# EAGLE design reed_relay_switcher (EAGLE 6.6.0)
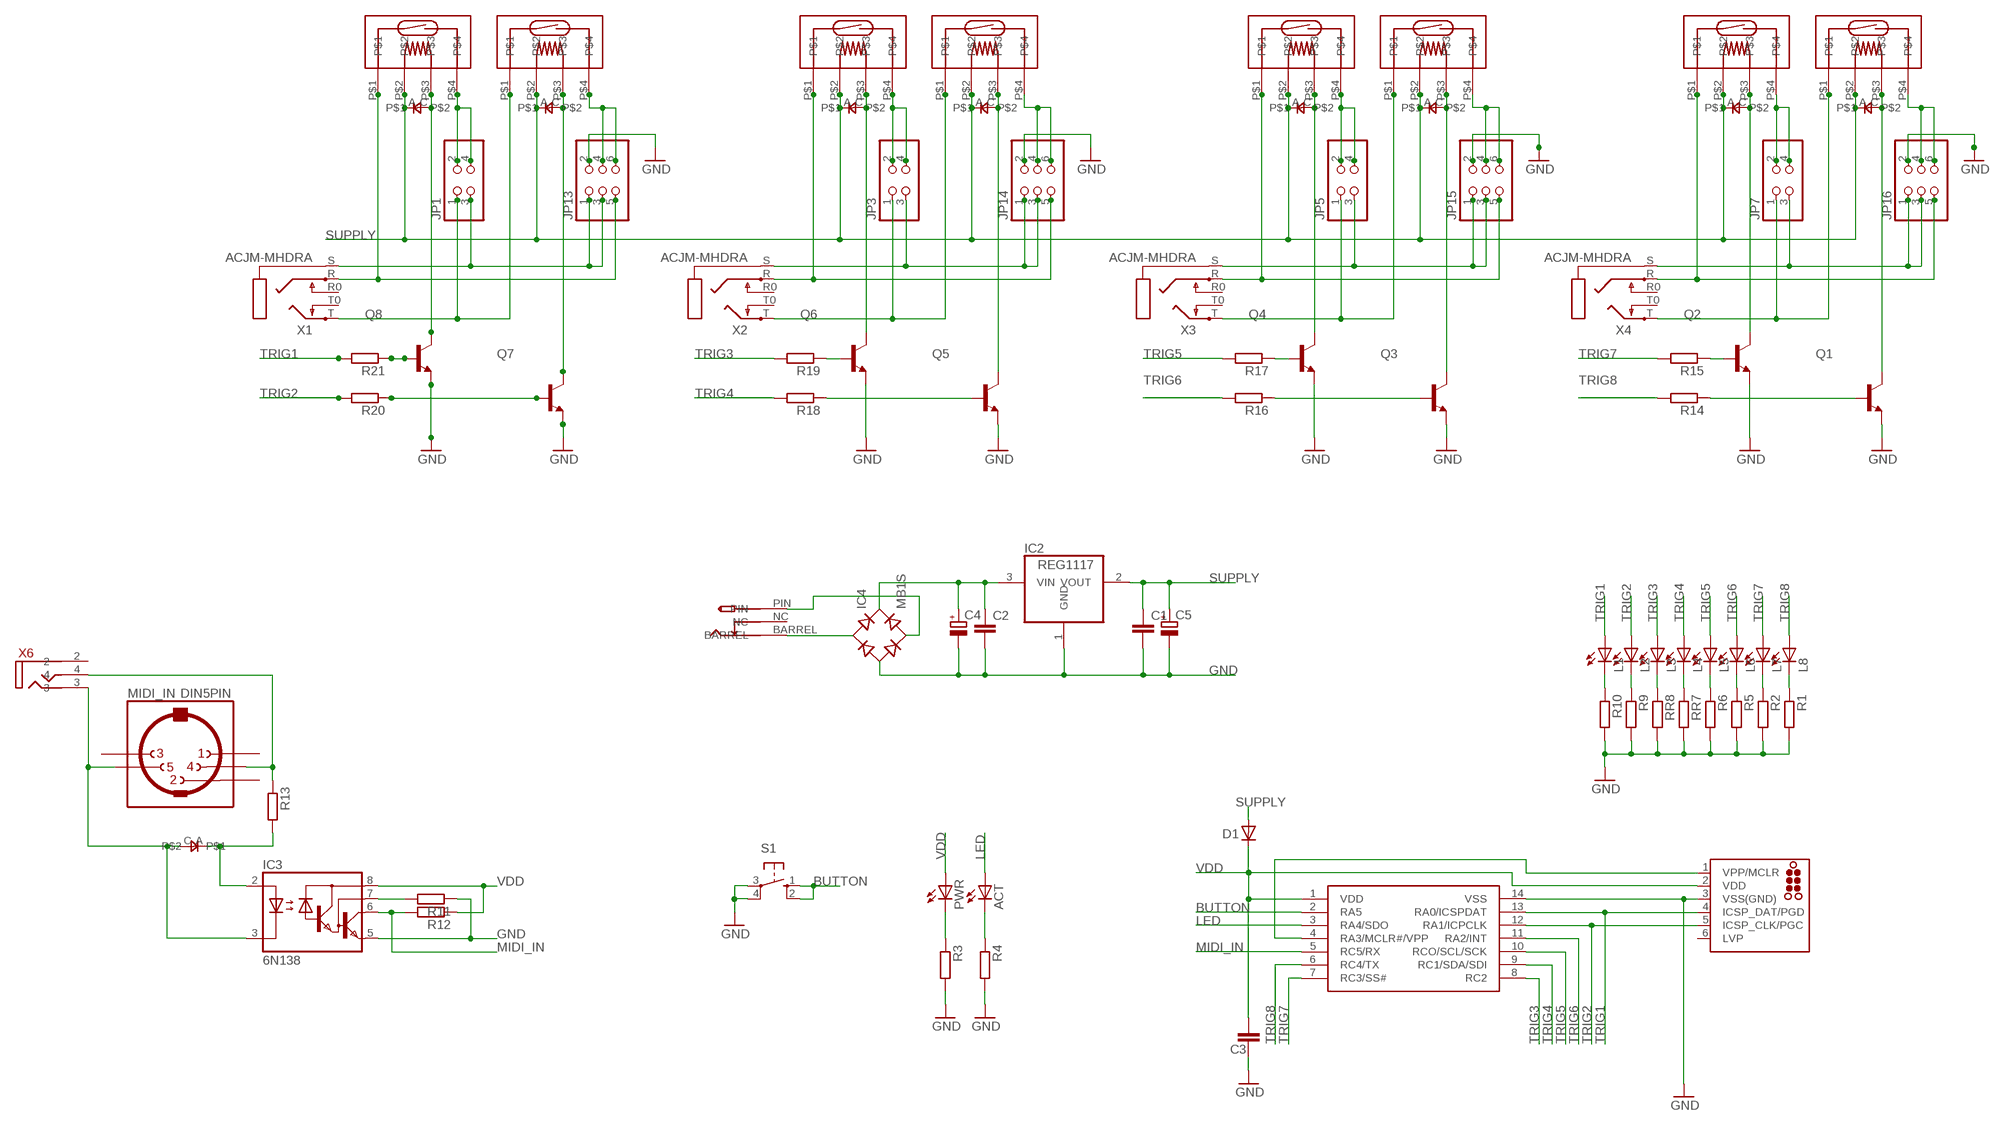
[diagram p0: schematic, sheet 1]

## Parts
ACT  LED3MM  [LED3MM]
C1  C-EUC0805  [C0805]
C2  C-EUC0805  [C0805]
C3  C-EUC0805  [C0805]
C4  CPOL-EUE2,5-6E  [E2,5-6E]
C5  CPOL-EUE2,5-6E  [E2,5-6E]
D1  CGRM4001-G  [SOD-123_MINI-SMA]
D2  0805DIODE  [0805DIODE]
D3  0805DIODE  [0805DIODE]
D4  0805DIODE  [0805DIODE]
D5  0805DIODE  [0805DIODE]
D6  0805DIODE  [0805DIODE]
D7  0805DIODE  [0805DIODE]
D8  0805DIODE  [0805DIODE]
D9  0805DIODE  [0805DIODE]
D10  0805DIODE  [0805DIODE]
IC1  PIC16F1825SO14  [SO14]
IC2  REG1117  [SOT223]
IC3  6N138  [DIL08]
IC4  MB1S  [SOIC-4]
ICSP  TC2030-MCP-NL  [TC2030-MCP-NL]
JP1  PINHD-2X2  [2X02]
JP3  PINHD-2X2  [2X02]
JP5  PINHD-2X2  [2X02]
JP7  PINHD-2X2  [2X02]
JP13  PINHD-2X3  [2X03]
JP14  PINHD-2X3  [2X03]
JP15  PINHD-2X3  [2X03]
JP16  PINHD-2X3  [2X03]
L1  LED3MM  [LED3MM]
L2  LED3MM  [LED3MM]
L3  LED3MM  [LED3MM]
L4  LED3MM  [LED3MM]
L5  LED3MM  [LED3MM]
L6  LED3MM  [LED3MM]
L7  LED3MM  [LED3MM]
L8  LED3MM  [LED3MM]
MIDI_IN  DIN5PIN  [EDGEDIN]
PWR  LED3MM  [LED3MM]
Q1  MMBT3904LT1-NPN-SOT23-BEC  [SOT23-BEC]
Q2  MMBT3904LT1-NPN-SOT23-BEC  [SOT23-BEC]
Q3  MMBT3904LT1-NPN-SOT23-BEC  [SOT23-BEC]
Q4  MMBT3904LT1-NPN-SOT23-BEC  [SOT23-BEC]
Q5  MMBT3904LT1-NPN-SOT23-BEC  [SOT23-BEC]
Q6  MMBT3904LT1-NPN-SOT23-BEC  [SOT23-BEC]
Q7  MMBT3904LT1-NPN-SOT23-BEC  [SOT23-BEC]
Q8  MMBT3904LT1-NPN-SOT23-BEC  [SOT23-BEC]
R1  R-EU_R0805  [R0805]
R2  R-EU_R0805  [R0805]
R3  R-EU_R0805  [R0805]
R4  R-EU_R0805  [R0805]
R5  R-EU_R0805  [R0805]
R6  R-EU_R0805  [R0805]
R9  R-EU_R0805  [R0805]
R10  R-EU_R0805  [R0805]
R11  R-EU_R0805  [R0805]
R12  R-EU_R0805  [R0805]
R13  R-EU_R0805  [R0805]
R14  R-EU_R0805  [R0805]
R15  R-EU_R0805  [R0805]
R16  R-EU_R0805  [R0805]
R17  R-EU_R0805  [R0805]
R18  R-EU_R0805  [R0805]
R19  R-EU_R0805  [R0805]
R20  R-EU_R0805  [R0805]
R21  R-EU_R0805  [R0805]
RLY1  9007-REED-RELAY  [9007-REED-RELAY]
RLY2  9007-REED-RELAY  [9007-REED-RELAY]
RLY3  9007-REED-RELAY  [9007-REED-RELAY]
RLY4  9007-REED-RELAY  [9007-REED-RELAY]
RLY5  9007-REED-RELAY  [9007-REED-RELAY]
RLY6  9007-REED-RELAY  [9007-REED-RELAY]
RLY7  9007-REED-RELAY  [9007-REED-RELAY]
RLY8  9007-REED-RELAY  [9007-REED-RELAY]
RR7  R-EU_R0805  [R0805]
RR8  R-EU_R0805  [R0805]
S1  10-XX  [B3F-10XX]
U$9  PWR_SOCKET_2_1MM  [PWR_SOCKET_2_1MM]
X1  ACJM-MHDRA  [ACJM-MHDR]
X2  ACJM-MHDRA  [ACJM-MHDR]
X3  ACJM-MHDRA  [ACJM-MHDR]
X4  ACJM-MHDRA  [ACJM-MHDR]
X6  VERTICAL_3_5MM_SOCKET  [VERTICAL_3_5MM_SOCKET]

## Nets
BUTTON: IC1.2(RA5) S1.1(S) S1.2(S1)
GND: C1.2 C2.2 C3.2 C4.- C5.- IC1.14(VSS) IC2.1(GND) IC3.5(GND) IC4.- ICSP.3(VSS(GND)) JP13.2 JP14.2 JP15.2 JP16.2 Q1.E Q2.E Q3.E Q4.E Q5.E Q6.E Q7.E Q8.E R1.2 R2.2 R3.2 R4.2 R5.2 R6.2 R9.2 R10.2 R11.1 RR7.2 RR8.2 S1.3(P) S1.4(P1)
LED: ACT.A IC1.3(RA4/SDO)
MIDI_IN: IC1.5(RC5/RX) IC3.6(VO) R12.2
N$1: JP1.2 JP1.4 RLY1.P$4
N$2: JP13.4 JP13.6 RLY2.P$4
N$3: JP13.5 RLY1.P$1 X1.R
N$4: JP1.1 RLY2.P$1 X1.T
N$5: JP1.3 JP13.1 JP13.3 X1.S
N$6: D9.C Q7.C RLY2.P$3
N$7: Q8.B R21.1
N$8: Q7.B R20.1
N$9: JP3.2 JP3.4 RLY3.P$4
N$10: D10.C Q8.C RLY1.P$3
N$11: JP14.4 JP14.6 RLY4.P$4
N$12: JP14.5 RLY3.P$1 X2.R
N$13: JP3.1 RLY4.P$1 X2.T
N$14: JP3.3 JP14.1 JP14.3 X2.S
N$15: D8.C Q6.C RLY3.P$3
N$16: D7.C Q5.C RLY4.P$3
N$17: Q6.B R19.1
N$18: Q5.B R18.1
N$19: JP5.2 JP5.4 RLY5.P$4
N$20: JP15.4 JP15.6 RLY6.P$4
N$21: JP15.5 RLY5.P$1 X3.R
N$22: JP5.1 RLY6.P$1 X3.T
N$23: JP5.3 JP15.1 JP15.3 X3.S
N$24: D6.C Q4.C RLY5.P$3
N$25: D5.C Q3.C RLY6.P$3
N$26: Q4.B R17.1
N$27: Q3.B R16.1
N$28: JP16.4 JP16.6 RLY8.P$4
N$29: JP7.2 JP7.4 RLY7.P$4
N$30: JP16.5 RLY7.P$1 X4.R
N$31: JP7.1 RLY8.P$1 X4.T
N$32: JP7.3 JP16.1 JP16.3 X4.S
N$33: D4.C Q2.C RLY7.P$3
N$34: D3.C Q1.C RLY8.P$3
N$35: Q2.B R15.1
N$36: Q1.B R14.1
N$37: D2.C IC3.3(C) MIDI_IN.5 X6.3
N$38: MIDI_IN.4 R13.1 X6.4
N$39: D2.A IC3.2(A) R13.2
N$40: IC3.7(VB) R11.2
N$41: PWR.K(C) R3.1
N$43: C2.1 C4.+ IC2.3(VIN) IC4.+
N$46: IC4.~1(AC1) U$9.BARREL
N$47: IC4.~2(AC2) U$9.PIN
N$48: ACT.K(C) R4.1
N$49: L1.K(C) R10.1
N$50: L2.K(C) R9.1
N$51: L3.K(C) RR8.1
N$52: L4.K(C) RR7.1
N$53: L5.K(C) R6.1
N$54: L6.K(C) R5.1
N$55: L7.K(C) R2.1
N$56: L8.K(C) R1.1
SUPPLY: C1.1 C5.+ D1.A D3.A D4.A D5.A D6.A D7.A D8.A D9.A D10.A IC2.2(VOUT) RLY1.P$2 RLY2.P$2 RLY3.P$2 RLY4.P$2 RLY5.P$2 RLY6.P$2 RLY7.P$2 RLY8.P$2
TRIG1: IC1.13(RA0/ICSPDAT) ICSP.4(ICSP_DAT/PGD) L1.A R21.2
TRIG2: IC1.12(RA1/ICPCLK) ICSP.5(ICSP_CLK/PGC) L2.A R20.2
TRIG3: IC1.8(RC2) L3.A R19.2
TRIG4: IC1.9(RC1/SDA/SDI) L4.A R18.2
TRIG5: IC1.10(RCO/SCL/SCK) L5.A R17.2
TRIG6: IC1.11(RA2/INT) L6.A R16.2
TRIG7: IC1.7(RC3/SS#) L7.A R15.2
TRIG8: IC1.6(RC4/TX) L8.A R14.2
VDD: C3.1 D1.C IC1.1(VDD) IC3.8(VCC) ICSP.2(VDD) PWR.A R12.1
VPP: IC1.4(RA3/MCLR#/VPP) ICSP.1(VPP/MCLR)
Unconnected: ICSP.6(LVP) MIDI_IN.1 MIDI_IN.2 MIDI_IN.3 U$9.NC X1.R0 X1.T0 X2.R0 X2.T0 X3.R0 X3.T0 X4.R0 X4.T0 X6.2

## Library data of the parts
ACT L1-L8 PWR = led:LED: LED OSRAM: - CHIPLED LG R971, LG N971, LY N971, LG Q971, LY Q971, LO R971, LY R971 LH N974, LH R974 LS Q976, LO Q976, LY Q976 LO Q996 - Hyper CHIPLED LW Q18S LB Q993, LB Q99A, LB R99A - SideLED LS A670, LO A670, LY A670, LG A670, LP A670 LB A673, LV A673, LT A673, LW A673 LH A674 LY A675 LS A676, LA A676, LO A676, LY A676, LW A676 LS A679, LY A679, LG A679 - Hyper Micro SIDELED® LS Y876, LA Y876, LO Y876, LY Y876 LT Y87S - SmartLED LW L88C, LW L88S LB L89C, LB L89S, LG L890 LS L89K, LO L89K, LY L89K LS L896, LA L896, LO L896, LY L896 - TOPLED LS T670, LO T670, LY T670, LG T670, LP T670 LSG T670, LSP T670, LSY T670, LOP T670, LYG T670 LG T671, LOG T671, LSG T671 LB T673, LV T673, LT T673, LW T673 LH T674 LS T676, LA T676, LO T676, LY T676, LB T676, LH T676, LSB T676, LW T676 LB T67C, LV T67C, LT T67C, LS T67K, LO T67K, LY T67K, LW E67C LS E67B, LA E67B, LO E67B, LY E67B, LB E67C, LV E67C, LT E67C LW T67C LS T679, LY T679, LG T679 LS T770, LO T770, LY T770, LG T770, LP T770 LB T773, LV T773, LT T773, LW T773 LH T774 LS E675, LA E675, LY E675, LS T675 LS T776, LA T776, LO T776, LY T776, LB T776 LHGB T686 LT T68C, LB T68C - Hyper Mini TOPLED® LB M676 - Mini TOPLED Santana® LG M470 LS M47K, LO M47K, LY M47K Source: http://www.osram.convergy.de LUXEON: - LUMILED® LXK2-PW12-R00, LXK2-PW12-S00, LXK2-PW14-U00, LXK2-PW14-V00 LXK2-PM12-R00, LXK2-PM12-S00, LXK2-PM14-U00 LXK2-PE12-Q00, LXK2-PE12-R00, LXK2-PE12-S00, LXK2-PE14-T00, LXK2-PE14-U00 LXK2-PB12-K00, LXK2-PB12-L00, LXK2-PB12-M00, LXK2-PB14-N00, LXK2-PB14-P00, LXK2-PB14-Q00 LXK2-PR12-L00, LXK2-PR12-M00, LXK2-PR14-Q00, LXK2-PR14-R00 LXK2-PD12-Q00, LXK2-PD12-R00, LXK2-PD12-S00 LXK2-PH12-R00, LXK2-PH12-S00 LXK2-PL12-P00, LXK2-PL12-Q00, LXK2-PL12-R00 Source: www.luxeon.com KINGBRIGHT: KA-3528ASYC Source: www.kingbright.com
C1-C3 = rcl:C-EU: CAPACITOR, European symbol
C4 C5 = rcl:CPOL-EU: POLARIZED CAPACITOR, European symbol
D1 = diode:CGRM400*-G: Molded plasitc,JEDEC SOD-123/Mini SMA Source: Comchip CGRM4001-G.pdf
D2-D10 = jasons_stuff:0805DIODE
IC1 = jasons_stuff:PIC16F1825
IC2 = burr-brown:REG1117: 800mA and 1A Low Dropout (LDO) Positive Regulator 1.8V, 2.5V, 2.85V, 3.3V, 5V, and Adj; MPN: REG1117; OC_FARNELL: 1097566; OC_NEWARK: 14P6981
IC3 = optocoupler:6N138: MOTOROLA OPTO COUPLER; MF: VISHAY/TELEFUNKEN; MPN: 6N138; OC_FARNELL: 9860150; OC_NEWARK: 35K5294
IC4 = rectifier:MB*S: Bridge Rectifier Source: http://www.fairchildsemi.com/ds/MB/MB6S.pdf
ICSP = tag-connect:TC2030: TAG-CONNECT ICSP Connector Manufacturer: Tag-Connect <http://www.tag-connect.com> Cable for easy In-Circuit Serial Programming. Designed for Microchip ICD2, suitable for many others. Two variants - one "with legs" (for hands-free fit on PCB) and another "without legs" for quick programming. PAD Description 1 MCLR/Vpp 2 Vdd 3 GND 4 PGD (ISPDAT) 5 PGC (ISPCLK) 6 nc (used for LVP) ©2009 ROFA.cz - modified and updated by Robert Darlington ‹rdarlington@gmail.com›
JP1 JP3 JP5 JP7 = pinhead:PINHD-2X2: PIN HEADER
JP13-JP16 = pinhead:PINHD-2X3: PIN HEADER
MIDI_IN = jason_eagle6:DIN5PIN: Female CONNECTOR 5 pins 90 deg. with shield, horizontal (DIN 41524)
Q1-Q8 = transistor:*-NPN-: NPN Transistror BF959 corrected 2008.03.06
R1-R6 R9-R21 RR7 RR8 = rcl:R-EU_: RESISTOR, European symbol
RLY1-RLY8 = jason_eagle6:9007-REED-RELAY
S1 = switch-omron:10-XX: OMRON SWITCH; MPN: B3F-1000; OC_FARNELL: 176432; OC_NEWARK: 36M3542
U$9 = jason_eagle6:PWR_SOCKET_2_1MM
X1-X4 = jason_eagle6:ACJM-MHDRA: MIC/HEADPHONE JACK Stereo jack with two switches. Kycon STX3100, CUI SJ1-3555NG and/or 4UCon 05544
X6 = jason_eagle6:VERTICAL_3_5MM_SOCKET

## Board
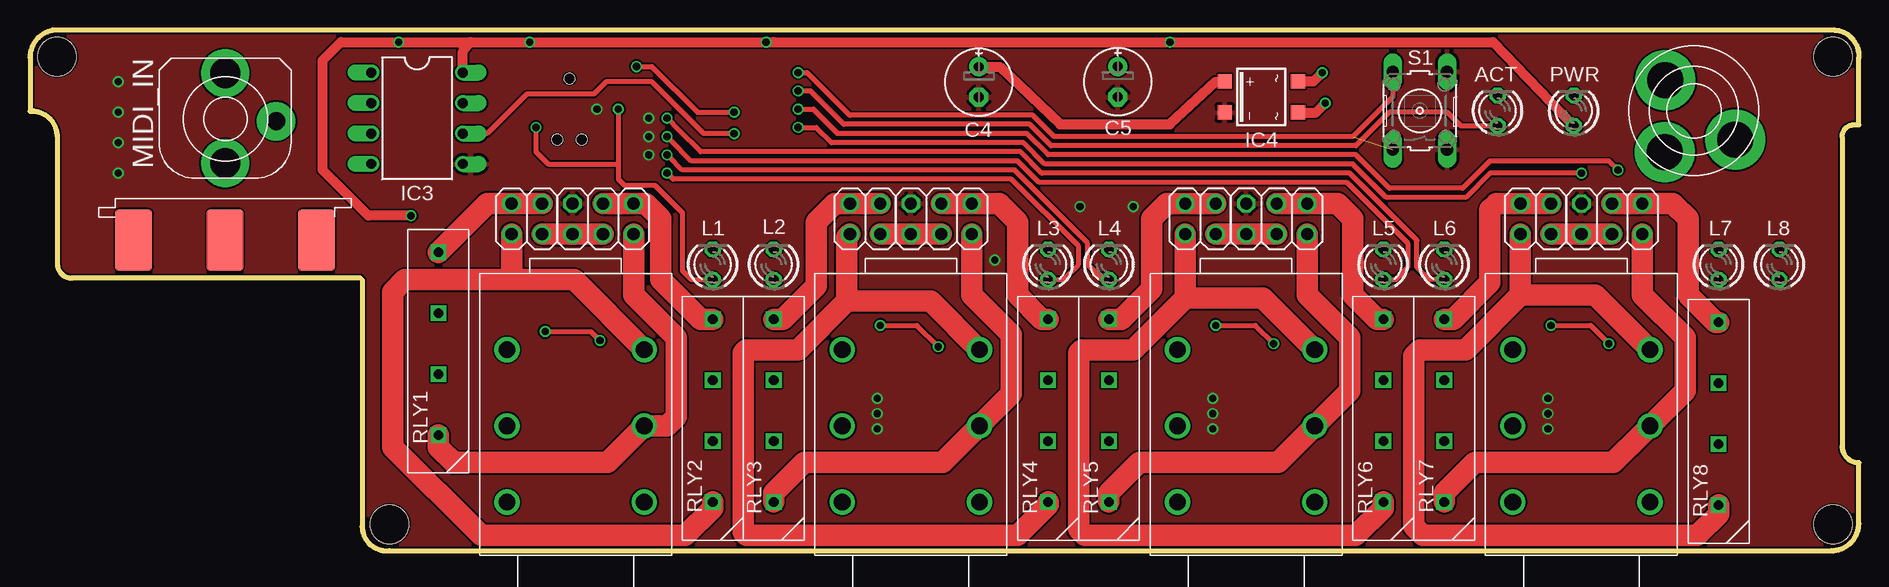
[diagram p1: board, top side]
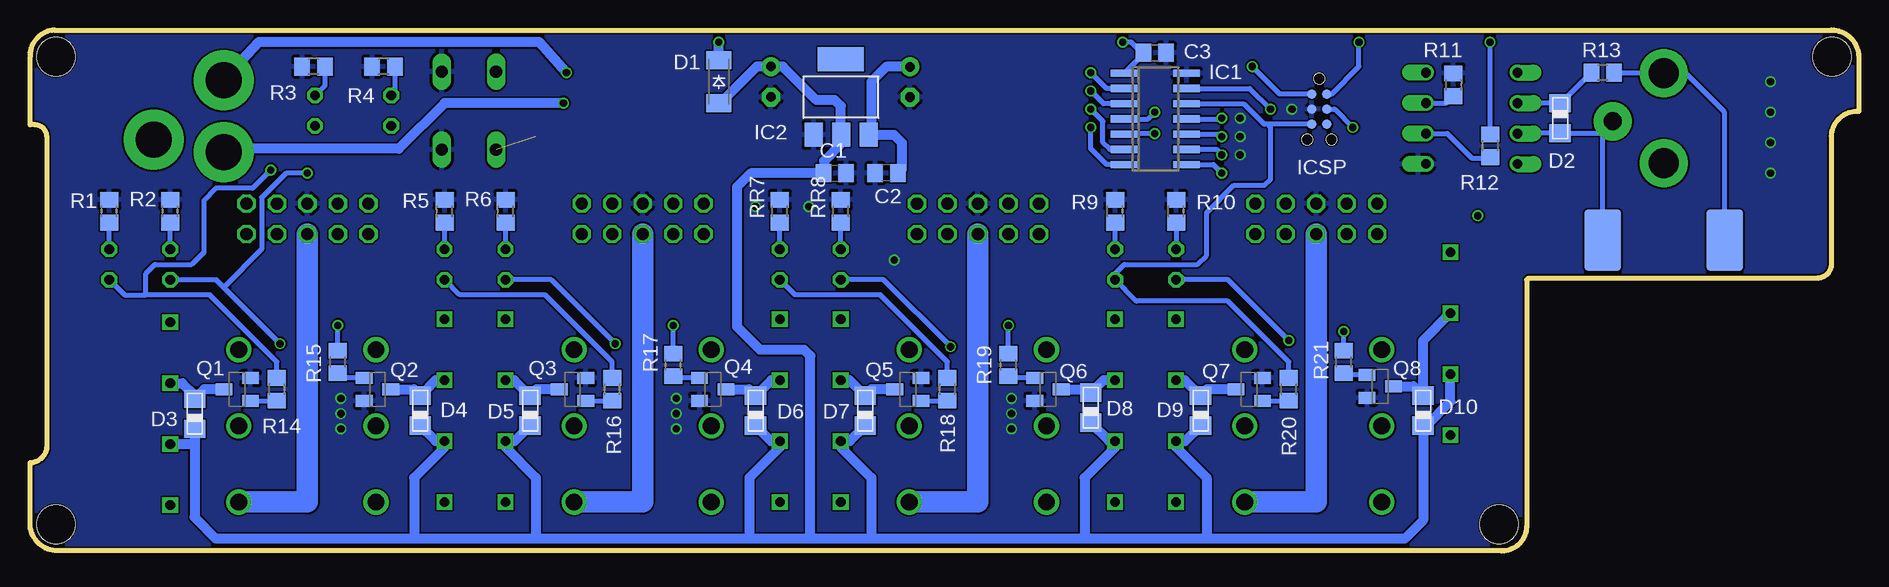
[diagram p2: board, bottom side, seen from below]

Size 152.4 x 43.45 mm. Coordinates in mm from the lower left corner, seen from the top.
Outline: 27.56,22.75 3.48,22.75
Outline: 3.48,22.75 3.43,22.75
Outline: 27.69,22.62 27.69,2.05 arc97 29.97,0.01 150.11,0.01 arc90 152.4,2.3 152.4,7.35 arc-90 151,8.75 151,34.53
Outline: 151,34.56 151,34.53
Outline: 2.29,34.56 2.29,34.53
Outline: 2.29,34.53 2.29,23.94 arc90 3.48,22.75
Outline: 2.29,34.53 arc90 0.15,36.67 0,36.67 0,41.16 arc-90 2.29,43.45 150.37,43.45 arc-90 152.4,41.16 152.4,35.55 152.02,35.55 arc90 151,34.53
Copper layers (1*16): Top 0.035mm / dielectric 1.5mm / Bottom 0.035mm
Design rules "hackvana": minimum track width 6mil, minimum drill 0.3mm, track to track 6mil, track to pad 9mil, pad to pad 6mil, via to via 6mil, smd to smd 0mil, copper to edge 6mil, drill to drill 6mil, minimum pad ring 10mil, minimum via ring 6mil, stop-mask expansion 2mil, vias tented up to drill 100mil, thermal gap 10mil
Holes 3.2 mm at 2.25,41.22 29.97,2.22 150.25,41.22 150.25,2.22

### Footprints (pad centres in the part's own frame; a part is rotated, then mirrored left to right if it is on the bottom)
LED3MM = drill 0.813 octagon: A -1.27,0; K 1.27,0
C0805 = smd 1.3 x 1.5: 1 -0.95,0; 2 0.95,0
E2,5-6E = drill 0.813 pad 1.575: + -1.27,0 | drill 0.813 pad 1.575 octagon: - 1.27,0
SOD-123_MINI-SMA = smd 1.5 x 2.1: A 1.8,0; C -1.8,0
0805DIODE = smd 1.524 x 1.778: A -1.262,-0.005; C 1.238,-0.005
SO14 = smd 0.6 x 2.2: 1 -3.81,-2.6; 2 -2.54,-2.6; 3 -1.27,-2.6; 4 0,-2.6; 5 1.27,-2.6; 6 2.54,-2.6; 7 3.81,-2.6; 8 3.81,2.6; 9 2.54,2.6; 10 1.27,2.6; 11 0,2.6; 12 -1.27,2.6; 13 -2.54,2.6; 14 -3.81,2.6
SOT223 = smd 1.499 x 2.007: 1 -2.261,-3.15; 2 0.025,-3.15; 3 2.311,-3.15 | smd 3.81 x 2.007: 4 0,3.15
DIL08 = drill 0.813 offset: 1 -3.81,-3.81; 2 -1.27,-3.81; 3 1.27,-3.81; 4 3.81,-3.81; 5 3.81,3.81; 6 1.27,3.81; 7 -1.27,3.81; 8 -3.81,3.81
SOIC-4 = smd 1.2 x 1.2: + 1.3,3.05; - -1.3,3.05; ~1 -1.3,-3.05; ~2 1.3,-3.05
TC2030-MCP-NL = smd 0.787 x 0.787: 1 1.27,-0.635; 2 1.27,0.635; 3 2.54,-0.635; 4 2.54,0.635; 5 3.81,-0.635; 6 3.81,0.635 | hole 0.889: 0,0; 5.08,-1.016; 5.08,1.016
2X02 = drill 1.016 octagon: 1 -1.27,-1.27; 2 -1.27,1.27; 3 1.27,-1.27; 4 1.27,1.27
2X03 = drill 1.016 octagon: 1 -2.54,-1.27; 2 -2.54,1.27; 3 0,-1.27; 4 0,1.27; 5 2.54,-1.27; 6 2.54,1.27
EDGEDIN = smd 3.048 x 5.08: 1 -7.62,-10.16; 2 0,-10.16; 3 7.62,-10.16 | smd 3.048 x 5.08 bottom: 4 -5.08,-10.16; 5 5.08,-10.16
SOT23-BEC = smd 1 x 1.4: B -0.95,-1.1; C 0,1.1; E 0.95,-1.1
R0805 = smd 1.3 x 1.5: 1 -0.95,0; 2 0.95,0
9007-REED-RELAY = drill 0.8 square: P$1 0,7.62; P$2 0,2.54; P$3 0,-2.54; P$4 0,-7.62
B3F-10XX = drill 1.016 long: 1 -3.251,2.261; 2 3.251,2.261; 3 -3.251,-2.261; 4 3.251,-2.261
PWR_SOCKET_2_1MM = drill 3 pad 5: BARREL 0,4.2; NC -4.2,0; PIN 3.4,-0.7
ACJM-MHDR = drill 1.397: R 0,5.715; R0 0,-5.715; S 6.35,5.715; S0 6.35,-5.715; T -6.35,5.715; T0 -6.35,-5.715
VERTICAL_3_5MM_SOCKET = drill 2.5 pad 4: 2 0,-3.75; 4 0,3.75 | drill 1.5 pad 3.2: 3 4.25,-0.25

### Placement (x,y rotation side)
ACT  122.3,36.72 90 top
C1  85.34,31.51 0 bottom
C2  81.03,31.51 180 bottom
C3  58.67,41.54 0 bottom
C4  79.07,39.1 270 top
C5  90.65,39.13 270 top
D1  95,39.13 270 bottom
D2  24.89,36.08 270 bottom
D3  138.68,11.44 90 bottom
D4  119.89,11.7 90 bottom
D5  110.74,11.7 90 bottom
D6  91.95,11.7 90 bottom
D7  82.8,11.7 90 bottom
D8  64.01,11.95 90 bottom
D9  54.86,11.7 90 bottom
D10  36.32,11.7 90 bottom
IC1  58.62,36.03 270 bottom
IC2  84.84,37.86 0 bottom
IC3  32.26,36.08 270 top
IC4  102.62,37.86 90 top
ICSP  44.96,39.38 270 bottom
JP1  41.4,27.7 0 top
JP3  69.6,27.7 0 top
JP5  97.54,27.7 0 top
JP7  125.48,27.7 0 top
JP13  47.75,27.7 0 top
JP14  75.95,27.7 0 top
JP15  103.89,27.7 0 top
JP16  131.83,27.7 0 top
L1  56.9,23.89 90 top
L2  61.98,23.89 90 top
L3  84.84,23.89 90 top
L4  89.92,23.89 90 top
L5  112.78,23.89 90 top
L6  117.86,23.89 90 top
L7  140.72,23.89 90 top
L8  145.8,23.89 90 top
MIDI_IN  16.26,36.08 0 top
PWR  128.65,36.72 90 top
Q1  135.13,13.48 90 bottom
Q2  123.44,13.48 270 bottom
Q3  107.19,13.48 90 bottom
Q4  95.5,13.48 270 bottom
Q5  79.25,13.48 90 bottom
Q6  67.56,13.48 270 bottom
Q7  50.8,13.48 90 bottom
Q8  39.88,13.73 270 bottom
R1  145.8,28.33 90 bottom
R2  140.72,28.33 90 bottom
R3  128.78,40.4 180 bottom
R4  122.94,40.4 180 bottom
R5  117.86,28.33 90 bottom
R6  112.78,28.33 90 bottom
R9  61.98,28.33 90 bottom
R10  56.9,28.33 90 bottom
R11  33.78,38.88 270 bottom
R12  30.73,33.8 270 bottom
R13  21.34,39.89 180 bottom
R14  131.83,13.48 90 bottom
R15  126.75,15.76 90 bottom
R16  103.89,13.48 90 bottom
R17  98.81,15.51 90 bottom
R18  75.95,13.48 90 bottom
R19  70.87,15.51 90 bottom
R20  47.5,13.48 90 bottom
R21  42.93,15.76 90 bottom
RLY1  34.04,17.29 180 top
RLY2  56.9,11.7 180 top
RLY3  61.98,11.7 180 top
RLY4  84.84,11.7 180 top
RLY5  89.92,11.7 180 top
RLY6  112.78,11.7 180 top
RLY7  117.86,11.7 180 top
RLY8  140.72,11.44 180 top
RR7  89.92,28.33 90 bottom
RR8  84.84,28.33 90 bottom
S1  115.82,36.72 90 top
U$9  138.65,36.72 145 top
X1  45.47,10.43 270 top
X2  73.41,10.43 270 top
X3  101.35,10.43 270 top
X4  129.29,10.43 270 top
X6  16.26,36.08 0 top

### Tracks (layer width: path | path; a pad name or v marks a point on that pad's centre or on a via)
BUTTON  (via drill 0.6)  (1 unrouted)
  Top 0.406: S1.2 113.56,37.88 110.24,34.56 85.34,34.56 83.57,36.34 68.33,36.34 64.77,39.89 v64.01,39.89
  Bottom 0.406: IC1.2 62.69,38.57 v64.01,39.89
GND  (via drill 0.6)
  other vias: 7.37,39.13 7.37,36.59 7.37,34.05 7.37,31.51 47.24,36.84 51.56,36.08 51.56,34.56 51.56,33.03 70.61,10.17 98.55,10.17 126.49,10.17 70.61,11.44 70.61,12.71 98.55,11.44 98.55,12.71 126.49,11.44 126.49,12.71 80.39,24.27 87.5,28.72 91.95,28.72
  pour Bottom: -5.33,46.75 -5.33,-14.21 157.23,-14.21 157.23,54.37 -5.33,54.37
  pour Top: -2.79,44.21 -2.79,-6.59 159.77,-6.59 159.77,51.83 -2.79,51.83
LED  (via drill 0.6)
  Top 0.406: ACT.A 119.25,35.45 118.11,36.59 113.28,36.59 110.49,33.8 85.09,33.8 83.31,35.57 67.82,35.57 65.02,38.37 v64.01,38.37
  Bottom 0.406: IC1.3 62.94,37.3 v64.01,38.37
MIDI_IN  (via drill 0.6)
  Top 0.406: v58.67,34.81 56.13,34.81 51.82,39.13 48.01,39.13 46.99,38.11 41.4,38.11 38.1,34.81 IC3.6
  Bottom 0.406: IC3.6 34.29,34.81 32.26,32.78 30.8,32.78 R12.2 | v58.67,34.81 61.17,34.81 IC1.5
N$1
  Top 1.778: JP1.4 JP1.2 38.1,28.97 RLY1.P$4
N$2
  Top 1.778: JP13.4 49.28,28.97 JP13.6 51.31,28.97 52.58,27.7 52.58,22.62 55.88,19.32 RLY2.P$4
N$3
  Top 1.778: JP13.5 50.29,21.35 53.85,17.79 53.85,11.19 53.09,10.43 X1.R 48.13,7.38 35.31,7.38 34.04,8.65 RLY1.P$1
N$4
  Top 1.778: X1.T 45.34,22.62 40.39,22.62 | RLY2.P$1 56.9,3.57 54.61,1.28 37.59,1.28 30.23,8.65 30.23,21.6 31.24,22.62 40.39,22.62 | JP1.1 40.13,22.87 40.39,22.62
N$5
  Top 1.778: JP1.3 JP13.1 JP13.3
  Bottom 1.778: X1.S 45.21,4.08 JP13.1
N$6
  Bottom 0.813: Q7.C 54.32,13.48 D9.C 56.16,14.24 RLY2.P$3
N$7
  Bottom 0.406: Q8.B 42.79,14.68 R21.1
N$8
  Bottom 0.406: Q7.B R20.1
N$9
  Top 1.778: RLY3.P$4 62.74,19.32 65.53,22.11 65.53,27.45 67.06,28.97 JP3.2 JP3.4
N$10
  Bottom 0.813: Q8.C 37.11,13.73 D10.C 36.32,17.54 RLY1.P$3
N$11
  Top 1.778: RLY4.P$4 84.33,19.32 82.3,21.35 82.3,27.45 80.77,28.97 JP14.6 JP14.4
N$12
  Top 1.778: RLY3.P$1 61.98,4.84 64.52,7.38 76.07,7.38 X2.R 81.79,13.09 81.79,18.05 78.49,21.35 JP14.5
N$13
  Top 1.778: RLY4.P$1 84.84,3.82 82.3,1.28 59.69,1.28 59.44,1.54 59.44,16.52 59.69,16.78 64.01,16.78 68.07,20.84 | 68.07,20.84 68.07,26.18 JP3.1 | 68.07,20.84 75.06,20.84 X2.T
N$14
  Top 1.778: JP3.3 JP14.1 JP14.3
  Bottom 1.778: JP14.1 73.41,4.08 X2.S
N$15
  Bottom 0.813: RLY3.P$3 62.96,14.24 D8.C 64.29,13.48 Q6.C
N$16
  Bottom 0.813: RLY4.P$3 84.1,14.24 D7.C 82.26,13.48 Q5.C
N$17
  Bottom 0.406: Q6.B 70.73,14.43 R19.1
N$18
  Bottom 0.406: Q5.B R18.1
N$19
  Top 1.778: RLY5.P$4 90.93,19.32 93.47,21.86 93.47,27.7 94.74,28.97 JP5.2 JP5.4
N$20
  Top 1.778: RLY6.P$4 112.27,19.32 110.24,21.35 110.24,27.7 108.97,28.97 JP15.6 JP15.4
N$21
  Top 1.778: RLY5.P$1 89.92,4.84 92.46,7.38 104.01,7.38 X3.R 109.98,13.35 109.98,17.79 106.43,21.35 JP15.5
N$22
  Top 1.778: RLY6.P$1 112.78,3.57 110.49,1.28 87.88,1.28 87.38,1.79 87.38,16.52 87.63,16.78 91.95,16.78 96.27,21.1 | 96.27,21.1 JP5.1 | 96.27,21.1 102.74,21.1 X3.T
N$23
  Top 1.778: JP5.3 JP15.1 JP15.3
  Bottom 1.778: JP15.1 101.35,4.08 X3.S
N$24
  Bottom 0.813: RLY5.P$3 90.64,14.24 D6.C 92.48,13.48 Q4.C
N$25
  Bottom 0.813: RLY6.P$3 112.04,14.24 D5.C 110.2,13.48 Q3.C
N$26
  Bottom 0.406: Q4.B 98.67,14.43 R17.1
N$27
  Bottom 0.406: Q3.B R16.1
N$28
  Top 1.778: RLY8.P$4 140.46,19.06 138.18,21.35 138.18,27.7 136.91,28.97 JP16.6 JP16.4
N$29
  Top 1.778: RLY7.P$4 118.62,19.32 121.67,22.37 121.67,28.46 122.17,28.97 JP7.2 JP7.4
N$30
  Top 1.778: RLY7.P$1 117.86,4.84 120.4,7.38 131.95,7.38 134.43,9.86 X4.R 137.92,13.35 137.92,17.79 134.37,21.35 JP16.5
N$31
  Top 1.778: RLY8.P$1 140.72,3.06 138.94,1.28 116.08,1.28 115.32,2.05 115.32,16.27 115.82,16.78 119.63,16.78 124.21,21.35 | 124.21,21.35 JP7.1 | 124.21,21.35 130.43,21.35 X4.T
N$32
  Top 1.778: JP7.3 JP16.1 JP16.3
  Bottom 1.778: JP16.1 129.29,4.08 X4.S
N$33
  Bottom 0.813: RLY7.P$3 118.62,14.24 119.13,13.73 119.13,13.69 D4.C 120.42,13.48 Q2.C
N$34
  Bottom 0.813: RLY8.P$3 139.7,13.98 138.68,12.96 D3.C 137.89,13.48 Q1.C
N$35
  Bottom 0.406: Q2.B 126.36,14.43 R15.1
N$36
  Bottom 0.406: Q1.B R14.1
N$37
  Bottom 0.406: IC3.3 28.42,34.84 D2.C 21.49,34.84 X6.3 21.34,35 MIDI_IN.5
N$38
  Bottom 0.406: MIDI_IN.4 11.18,36.59 14.42,39.83 X6.4 20.33,39.83 R13.1
N$39
  Bottom 0.406: R13.2 24.83,37.34 D2.A IC3.2
N$40
  Bottom 0.406: IC3.7 34.36,37.35 R11.2
N$41
  Bottom 0.406: R3.1 127.83,38.81 PWR.K
N$43
  Top 0.813: C4.+ 80.8,40.37 85.85,35.57 95,35.57 98.81,39.13 99.54,39.13 IC4.+
  Bottom 0.813: C2.1 79.76,31.83 79.76,34.05 80.42,34.71 IC2.3 82.3,34.94 82.3,39.13 81.05,40.37 C4.+
N$46  (via drill 0.6)
  Top 0.813: IC4.~1 107.16,36.56 v107.95,37.35
  Bottom 0.813: v107.95,37.35 117.86,37.35 121.67,33.54 135.98,33.54 U$9.BARREL
N$47  (via drill 0.6)
  Top 0.813: IC4.~2 106.96,39.16 v107.7,39.89
  Bottom 0.813: v107.7,39.89 109.98,42.43 133.33,42.43 U$9.PIN
N$48
  Bottom 0.406: R4.1 121.99,38.3 ACT.K
N$49
  Bottom 0.406: R10.1 L1.K
N$50
  Bottom 0.406: L2.K R9.1
N$51
  Bottom 0.406: L3.K RR8.1
N$52
  Bottom 0.406: L4.K RR7.1
N$53
  Bottom 0.406: L5.K R6.1
N$54
  Bottom 0.406: L6.K R5.1
N$55
  Bottom 0.406: L7.K R2.1
N$56
  Bottom 0.406: L8.K R1.1
SUPPLY
  Bottom 0.813: D9.A 56.14,9.16 RLY2.P$2 56.9,8.65 54.36,6.11 54.36,1.03 | RLY1.P$2 34.04,12.46 36.06,10.44 D10.A 36.32,2.56 37.85,1.03 54.36,1.03 | D8.A 62.47,9.16 RLY3.P$2 61.98,8.65 64.52,6.11 64.52,1.03 | D7.A 84.08,9.16 RLY4.P$2 84.84,8.65 82.3,6.11 82.3,1.03 | D6.A 90.66,9.16 RLY5.P$2 89.92,8.65 92.46,6.11 92.46,1.03 | D5.A 112.02,9.16 RLY6.P$2 112.78,8.65 110.24,6.11 110.24,1.03 | D4.A 118.6,9.16 RLY7.P$2 117.86,8.65 120.4,6.11 120.4,1.03 | RLY8.P$2 138.94,8.9 138.68,9.16 D3.A 138.68,2.8 136.91,1.03 120.4,1.03 | 54.36,1.03 64.52,1.03 | 64.52,1.03 82.3,1.03 | 82.3,1.03 87.38,1.03 | 87.38,1.03 92.46,1.03 | 92.46,1.03 110.24,1.03 | 110.24,1.03 120.4,1.03 | D1.A 94.89,37.33 91.82,40.4 C5.+ 89.66,40.4 86.87,37.61 85.34,37.61 84.84,37.1 84.84,34.74 IC2.2 84.81,33.95 86.23,32.53 86.23,31.57 C1.1 92.33,31.51 93.47,30.37 93.47,18.68 91.57,16.78 87.88,16.78 87.38,16.27 87.38,1.03
TRIG1  (via drill 0.6)
  Top 0.406: v42.93,18.3 46.74,18.3 v47.5,17.54 | v49.02,36.84 49.02,32.27 | 49.02,32.27 49.02,31 49.53,30.49 52.07,30.49 54.36,28.21 54.36,23.38 55.12,22.62 L1.A | v42.16,35.32 42.16,33.29 43.18,32.27 49.02,32.27
  Bottom 0.406: R21.2 v42.93,18.3 | v47.5,17.54 52.58,22.62 L1.A | IC1.13 50.75,38.57 v49.02,36.84 | ICSP.4 43.69,36.84 v42.16,35.32
TRIG2
  Bottom 0.406: R20.2 47.5,15.76 52.58,20.84 60.2,20.84 L2.A 61.98,23.13 61.21,23.89 55.12,23.89 54.36,24.65 54.36,28.21 52.07,30.49 49.53,30.49 49.02,31 49.02,35.32 49.28,35.57 | IC1.12 51.26,37.3 49.53,35.57 49.28,35.57 | ICSP.5 49.28,35.57
TRIG3  (via drill 0.6)
  Top 0.406: v70.87,18.81 73.91,18.81 v75.69,17.03 | L3.A 86.11,22.62 87.38,23.89 87.38,25.41 81.79,31 53.59,31 v53.09,31.51
  Bottom 0.406: R19.2 v70.87,18.81 | v75.69,17.03 81.28,22.62 L3.A | IC1.8 53.8,32.22 v53.09,31.51
TRIG4  (via drill 0.6)
  Top 0.406: L4.A 89.41,22.62 88.14,23.89 88.14,25.67 82.04,31.76 54.36,31.76 53.21,32.91 v53.09,33.03
  Bottom 0.406: R18.2 75.95,15.76 81.53,21.35 88.65,21.35 L4.A | IC1.9 53.54,33.49 v53.09,33.03
TRIG5  (via drill 0.6)
  Top 0.406: v98.81,18.81 102.11,18.81 v103.63,17.29 | L5.A 113.79,22.62 114.81,23.64 114.81,25.67 109.73,30.75 84.07,30.75 82.3,32.53 55.12,32.53 53.34,34.3 v53.09,34.56
  Bottom 0.406: R17.2 v98.81,18.81 | L5.A 108.97,22.62 v103.63,17.29 | IC1.10 53.29,34.76 v53.09,34.56
TRIG6  (via drill 0.6)
  Top 0.406: L6.A 116.59,22.62 115.57,23.64 115.57,25.92 109.98,31.51 84.33,31.51 82.55,33.29 55.88,33.29 54.1,35.07 v53.09,36.08
  Bottom 0.406: R16.2 103.89,15.76 109.47,21.35 116.59,21.35 L6.A | IC1.11 53.14,36.03 v53.09,36.08
TRIG7  (via drill 0.6)
  Top 0.406: v126.75,18.81 130.05,18.81 v131.57,17.29 | v129.29,31.51 121.67,31.51 119.63,29.48 113.03,29.48 110.24,32.27 84.58,32.27 82.8,34.05 66.8,34.05 65.53,35.32 v64.01,35.32
  Bottom 0.406: R15.2 v126.75,18.81 | v131.57,17.29 136.27,21.98 | 136.27,21.98 136.91,22.62 L7.A | IC1.7 62.69,32.22 64.01,33.54 v64.01,35.32 | v129.29,31.51 131.06,31.51 133.1,29.48 133.1,25.16 136.27,21.98
TRIG8  (via drill 0.6)
  Top 0.406: v132.33,31.76 131.57,32.53 121.67,32.53 119.38,30.24 113.28,30.24 110.49,33.03 84.84,33.03 83.06,34.81 67.31,34.81 65.28,36.84 v64.01,36.84
  Bottom 0.406: R14.2 131.83,15.76 137.41,21.35 142.75,21.35 | L8.A 144.53,21.35 142.75,21.35 | 142.75,21.35 142.75,23.13 141.99,23.89 138.94,23.89 137.92,24.91 137.92,29.22 136.91,30.24 133.86,30.24 v132.33,31.76 | IC1.6 62.43,33.49 62.99,34.05 62.99,35.83 v64.01,36.84
VDD  (via drill 0.6)
  Top 0.813: IC3.8 36.07,41.67 36.7,42.43 | v31.75,27.95 28.19,27.95 24.38,31.76 24.38,40.91 25.91,42.43 v30.73,42.43 36.7,42.43 | 36.7,42.43 v41.66,42.43 v61.34,42.43 61.98,42.43 v95,42.43 121.92,42.43 PWR.A
  Bottom 0.406: R12.1 v30.73,42.43 | ICSP.2 43.94,38.11 41.66,40.4 v41.66,42.43 | IC1.1 59.62,41.44 | 59.62,41.44 C3.1 | 59.62,41.44 60.62,42.43 v61.34,42.43
  Bottom 0.813: D1.C v95,42.43
VPP  (via drill 0.6)
  Top 0.406: v50.55,40.4 51.82,40.4 55.63,36.59 v58.67,36.59
  Bottom 0.406: IC1.4 59.23,36.03 v58.67,36.59 | ICSP.1 48.26,38.11 v50.55,40.4

### Text on the board
tDocu: MIDI SWITCHER | TRS | rev 1 | six4pix.com/switcher | RT | RS | SG | TS | TR | RT | RS | SG | TS | TR | RT | RS | SG | TS | TR | RT | RS | A/B | C/D | E/F | G/H | SG | TS | TR | hotchk155